# Altium schematic sheet NEMA_POWER.SchDoc
size A3; SheetNumber: 2; SheetTotal: 4
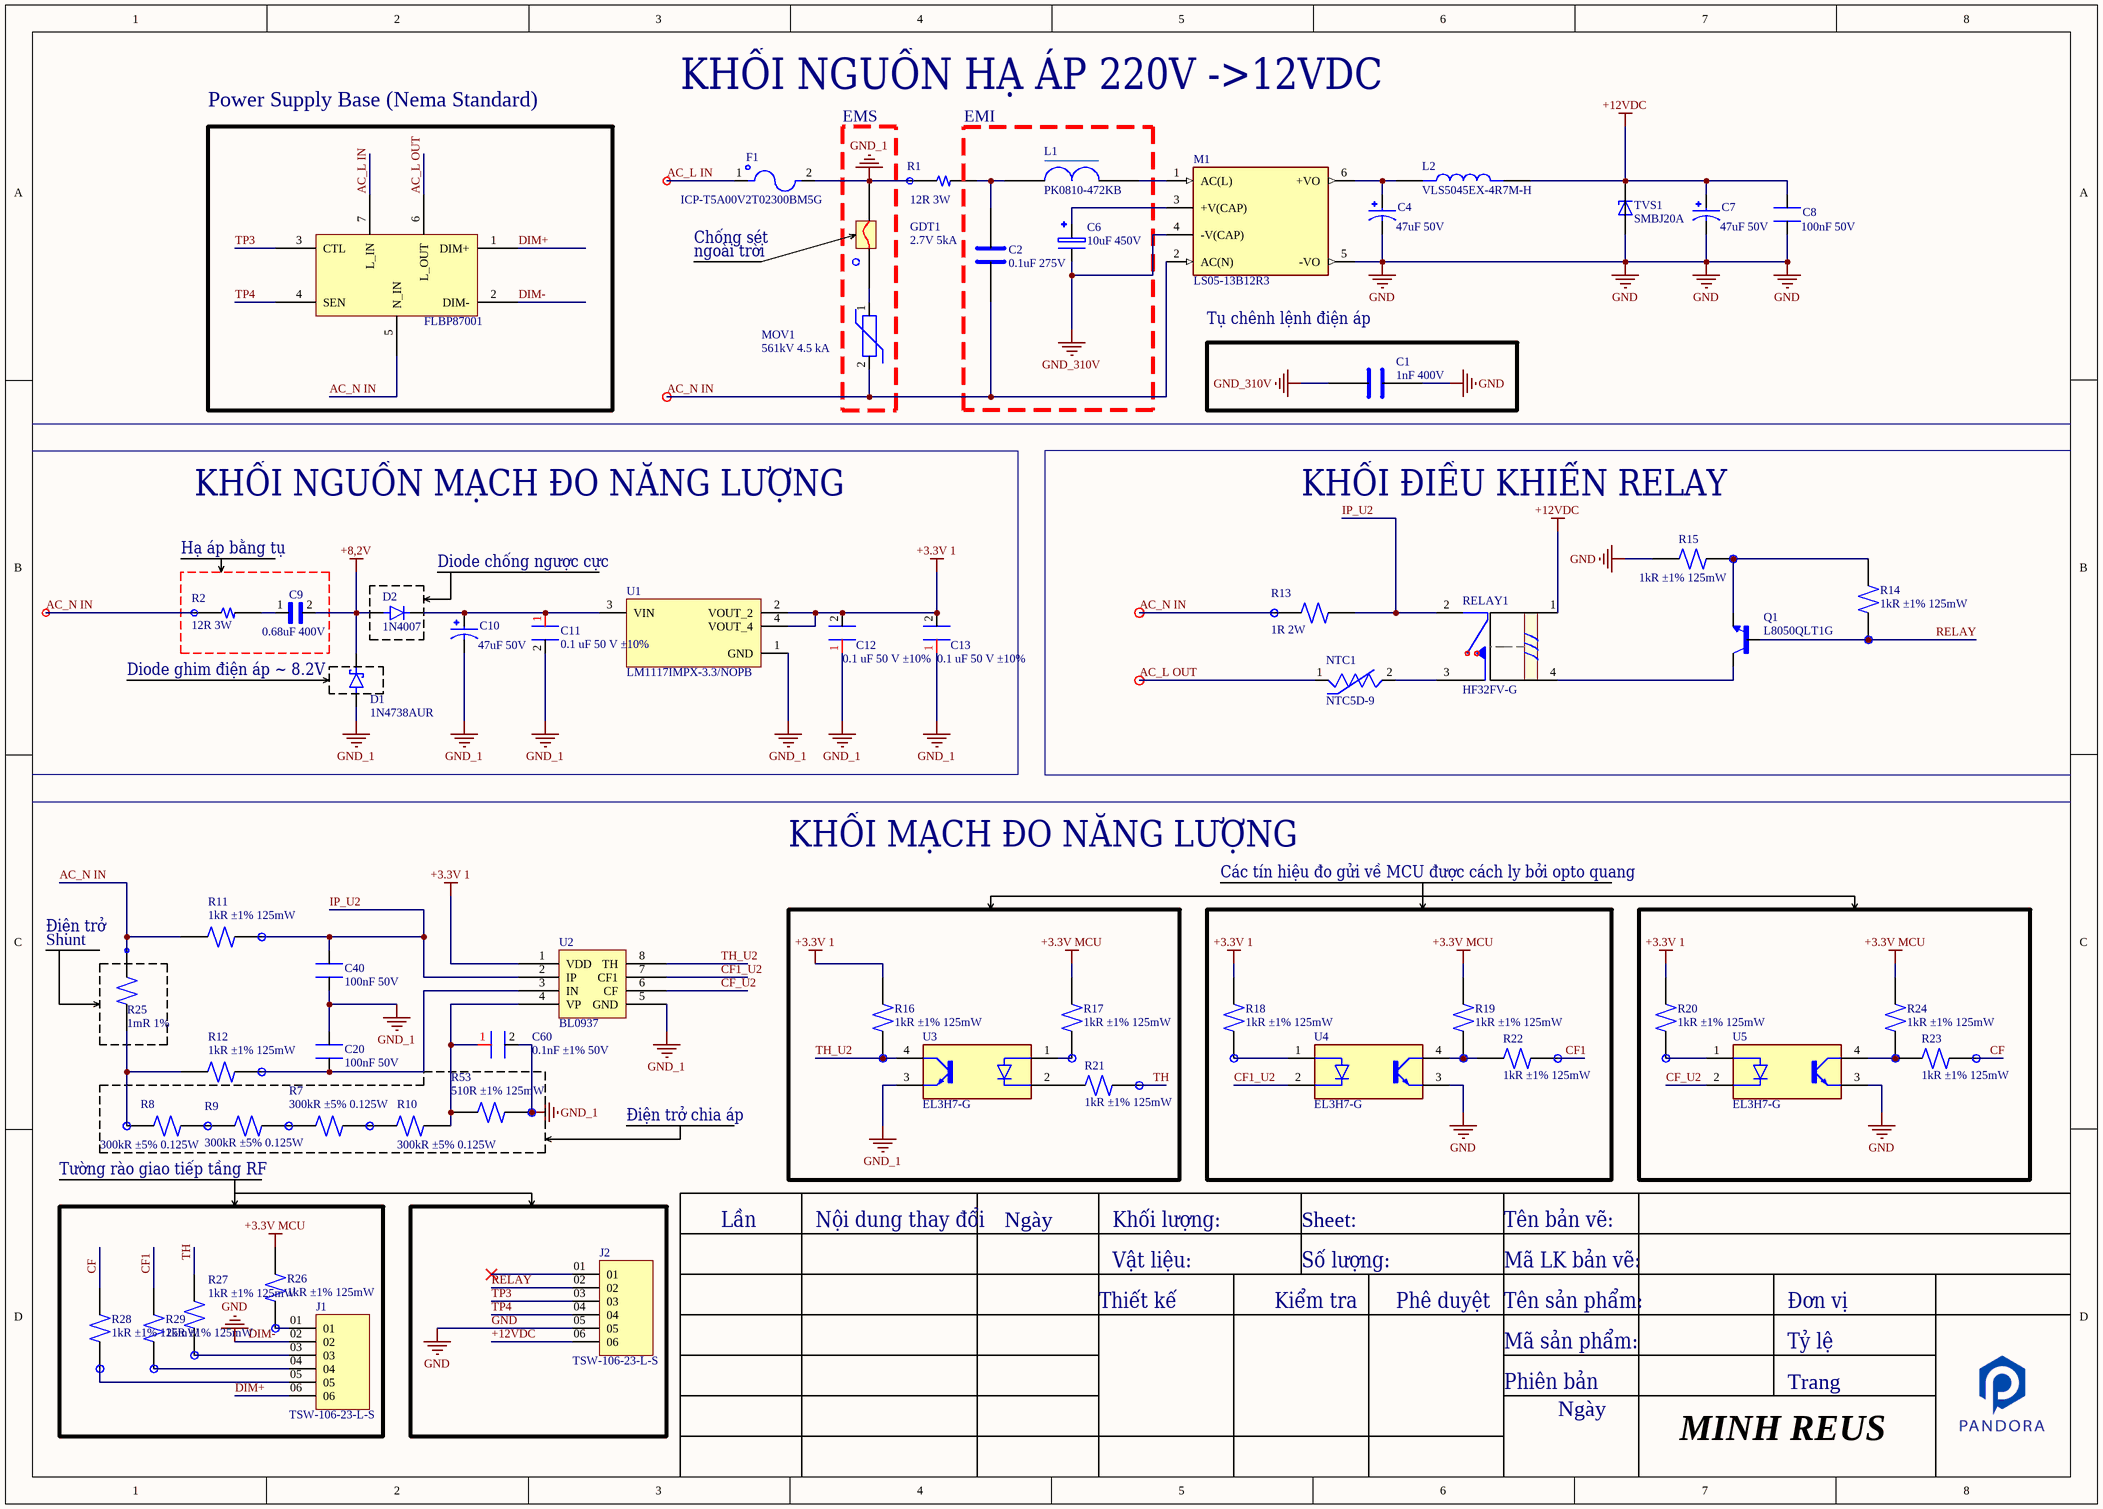
[diagram p0: NEMA_POWER.SchDoc]

## Parts
?  FLBP87001  [HEADER-JL241J]
C1  value 1nF 400V  [CAP-CER HIGH VOLTAGE 12x5mm]  (hidden comment: JD102MY5U)
C2  Values: 0.1uF 275V  [CAP_FILM DIP 0.1uF 15x12x4mm]  (hidden comment: ECW-FE2W154JA)
C4  value 47uF 50V  [CAP-POLARIZED_TH 50V 5x2.5mm]  (hidden comment: ECA1HM470)
C6  value 10uF 450V  [CAP-POLARIZED TH 450V 13x5mm]  (hidden comment: ECA2WHG100E)
C7  value 47uF 50V  [CAP-POLARIZED_TH 50V 5x2.5mm]  (hidden comment: ECA1HM470)
C8  value 100nF 50V  [CAP-CER_0805 SMD 2.01x1.25mm]  (hidden comment: SMC0805K104)
C9  value 0.68uF 400V  [CAP-FILM 0.68uF 400V DIP 15x18x7.8mm]  (hidden comment: P684J400)
C10  value 47uF 50V  [CAP-POLARIZED_TH 50V 5x2.5mm]  (hidden comment: ECA1HM470)
C11  0.1 uF 50 V ±10%  [CAP-CER_0805 SMD 2.01x1.25mm]
C12  0.1 uF 50 V ±10%  [CAP-CER_0805 SMD 2.01x1.25mm]
C13  0.1 uF 50 V ±10%  [CAP-CER_0805 SMD 2.01x1.25mm]
C20  value 100nF 50V  [CAP-CER_0805 SMD 2.01x1.25mm]  (hidden comment: SMC0805K104)
C40  value 100nF 50V  [CAP-CER_0805 SMD 2.01x1.25mm]  (hidden comment: SMC0805K104)
C60  0.1nF ±1% 50V  [CAP-CER_0805 SMD 2.01x1.25mm]
D1  1N4738AUR  [DIODE-ZENER 1N4738AUR]
D2  1N4007  [DIODE-RETIFIER_1N4007]
F1  ICP-T5A00V2T02300BM5G  [FUSE_ICP-T5A00V2T02300BM5G 3.6x10mm]
GDT1  value 2.7V 5kA  [VAR-GDT_5kA]  (hidden comment: GDT28H-270-BRP)
J1  TSW-106-23-L-S  [JUMP-6PIN_TH]
J2  TSW-106-23-L-S  [JUMP-6PIN_TH]
L1  PK0810-472KB  [IND-TH_0810 7x11mm]
L2  VLS5045EX-4R7M-H  [IND-SMD_VLS5045EX-4R7M-H 4.5X5.3MM]
M1  LS05-13B12R3  [MODULE-AC/DC_LS05-13B05R3]
MOV1  value 561kV 4.5 kA  [VAR-MOV_14D561K]  (hidden comment: MOV-14D471K)
NTC1  NTC5D-9  [RES-NTC_NTC5D-9 4x9mm]
Q1  L8050QLT1G  [TRANS-NPN_L8050QLT1G]
R1  value 12R 3W  [RES_2512 SMD 6.3x2.15x0.7mm]  (hidden comment: 2176231-3)
R2  value 12R 3W  [RES_2512 SMD 6.3x2.15x0.7mm]  (hidden comment: 2176231-3)
R7  300kR ±5% 0.125W  [RES_0805 2x1.25mm]
R8  300kR ±5% 0.125W  [RES_0805 2x1.25mm]
R9  300kR ±5% 0.125W  [RES_0805 2x1.25mm]
R10  300kR ±5% 0.125W  [RES_0805 2x1.25mm]
R11  1kR ±1% 125mW  [RES_0805 2x1.25mm]
R12  1kR ±1% 125mW  [RES_0805 2x1.25mm]
R13  value 1R 2W  [RES_2512 SMD 6.3x2.15x0.7mm]  (hidden comment: PA2512FKE7W0R001E)
R14  1kR ±1% 125mW  [RES_0805 2x1.25mm]
R15  1kR ±1% 125mW  [RES_0805 2x1.25mm]
R16  1kR ±1% 125mW  [RES_0805 2x1.25mm]
R17  1kR ±1% 125mW  [RES_0805 2x1.25mm]
R18  1kR ±1% 125mW  [RES_0805 2x1.25mm]
R19  1kR ±1% 125mW  [RES_0805 2x1.25mm]
R20  1kR ±1% 125mW  [RES_0805 2x1.25mm]
R21  1kR ±1% 125mW  [RES_0805 2x1.25mm]
R22  1kR ±1% 125mW  [RES_0805 2x1.25mm]
R23  1kR ±1% 125mW  [RES_0805 2x1.25mm]
R24  1kR ±1% 125mW  [RES_0805 2x1.25mm]
R25  value 1mR 1%  [RES_6432]  (hidden comment: CRE2512-FZ-R002E-3)
R26  1kR ±1% 125mW  [RES_0805 2x1.25mm]
R27  1kR ±1% 125mW  [RES_0805 2x1.25mm]
R28  1kR ±1% 125mW  [RES_0805 2x1.25mm]
R29  1kR ±1% 125mW  [RES_0805 2x1.25mm]
R53  510R ±1% 125mW  [RES_0805 2x1.25mm]
RELAY1  HF32FV-G  [RELAY 10A 4PIN 0.2x18.4mm]
TVS1  SMBJ20A  [DIODE-TVS_SMD SMBJ20A 2x0.8mm]
U1  LM1117IMPX-3.3/NOPB  [IC_LM1117IMPX-3.3V]
U2  BL0937  [IC_BL0937]
U3  EL3H7-G  [TRANS-OPTO_EL3H7-G]
U4  EL3H7-G  [TRANS-OPTO_EL3H7-G]
U5  EL3H7-G  [TRANS-OPTO_EL3H7-G]

## Blocks framed on the sheet
Power Supply Base (Nema Standard): ?
EMS: GDT1 MOV1
EMI: C2 C6 L1
Tụ chênh lệnh điện áp: C1
Hạ áp bằng tụ: C9 R2

## Nets
+3.3V 1: C12.2 C13.2 R16.2 R18.2 R20.2 U1.2(VOUT_2) U1.4(VOUT_4) U2.1(VDD)
+3.3V MCU: R17.2 R19.2 R24.2 R26.2
+8,2V: C9.2 D1.K D2.A
+12VDC: C7.1 C8.2 J2.06 L2.2 RELAY1.1 TVS1.C
DIM-: ?.2(DIM-) C1.2 C4.2 C7.2 C8.1 J1.02 J2.05 M1.5(-VO) R15.2 TVS1.A U4.3(E) U5.3(E)  [also labelled GND]
GND_1: C10.2 C11.2 C12.1 C13.1 C20.1 C40.2 C60.2 D1.A F1.2 GDT1.1 R1.1 R53.1 U1.1(GND) U2.5(GND) U3.3(E)
GND_310V: C1.1 C6.2 M1.4(-V(CAP))
AC_L IN: ?.7(L_IN) F1.1
AC_L OUT: ?.6(L_OUT) NTC1.1
AC_N IN: ?.5(N_IN) C2.1 M1.2(AC(N)) MOV1.2 R2.1 R11.2 R13.1 R25.1
CF: R23.1 R28.2
CF1: R22.1 R29.2
CF1_U2: U2.7(CF1) U4.2(C)
CF_U2: U2.6(CF) U5.2(C)
DIM+: ?.1(DIM+) J1.06
IP_U2: C40.1 R11.1 R13.2 RELAY1.2 U2.2(IP)
RELAY: J2.02 Q1.1(B) R14.1
TH: R21.1 R27.2
TH_U2: R16.1 U2.8(TH) U3.4(CO)
TP3: ?.3(CTL) J2.03
TP4: ?.4(SEN) J2.04
NetC2_2: C2.2 L1.1 R1.2
NetC4_1: C4.1 L2.1 M1.6(+VO)
NetC6_1: C6.1 M1.3(+V(CAP))
NetC9_1: C9.1 R2.2
NetC10_1: C10.1 C11.1 D2.C U1.3(VIN)
NetC20_2: C20.2 R12.1 U2.3(IN)
NetC60_1: C60.1 R10.2 R53.2 U2.4(VP)
NetGDT1_2: GDT1.2 MOV1.1
NetJ1_01: J1.01 R26.1
NetJ1_03: J1.03 R27.1
NetJ1_04: J1.04 R29.1
NetJ1_05: J1.05 R28.1
NetL1_2: L1.2 M1.1(AC(L))
NetNTC1_2: NTC1.2 RELAY1.3
NetQ1_2: Q1.2(E) R14.2 R15.1
NetQ1_3: Q1.3(C) RELAY1.4
NetR7_1: R7.1 R9.2
NetR7_2: R7.2 R10.1
NetR8_1: R8.1 R12.2 R25.2
NetR8_2: R8.2 R9.1
NetR17_1: R17.1 U3.1(A)
NetR18_1: R18.1 U4.1(A)
NetR19_1: R19.1 R22.2 U4.4(CO)
NetR20_1: R20.1 U5.1(A)
NetR21_2: R21.2 U3.2(C)
NetR23_2: R23.2 R24.1 U5.4(CO)

Not connected (* = marked no-connect by the designer): J2 01*

## Notes on the sheet
- KHỐI NGUỒN HẠ ÁP 220V ->12VDC
- (near F1) Chống sét
- ngoài trời
- KHỐI NGUỒN MẠCH ĐO NĂNG LƯỢNG
- KHỐI ĐIỀU KHIỂN RELAY
- Diode chống ngược cực
- (near D1) Diode ghim điện áp ~ 8.2V
- KHỐI MẠCH ĐO NĂNG LƯỢNG
- Các tín hiệu đo gửi về MCU được cách ly bởi opto quang
- (near R25) Điện trở
- (near R25) Shunt
- Điện trở chia áp
- Tường rào giao tiếp tầng RF
- Lần
- Nội dung thay đổi
- Ngày
- Khối lượng:
- Sheet:
- Tên bản vẽ:
- Thiết kế
- Vật liệu:
- Kiểm tra
- Số lượng:
- Phê duyệt
- Mã LK bản vẽ:
- Tên sản phẩm:
- Đơn vị
- Mã sản phẩm:
- Phiên bản
- Tỷ lệ
- Trang
- MINH REUS

## Library data of the parts
? = HEADER AC_IN ;NEMA BASE: HEADER AC_IN ;NEMA BASE AC VOLTAGE FLBP87001; 7 Contacts (3 Power, 4Signal) 84.00mm base diameter Non-vented; Manufacture: Commercial industrial; Link in VN: NA; Value: NA; Manufacture part number: FLBP87001; Link: https://www.amphenol-cs.com/product/flbp87001.html; Package: NEMA Standard
C1 = CAP_CER;TH;1nF 400V: CAP_CER;TH;1nF 400V; Safety ceramic capacitor high voltage; Manufacture: Radial; Link in VN: NA; Manufacture part number: JD102MY5U; Link: https://www.it-tronics.de/en/ceramic-capacitor-1nf-400v-ac-hitano-jd102my5u-y1-d6x5mm-1000pf/; Package: DIP TH
C2 = CAR_FILM;TH; 0.1uF 275V: CAR FILM Polypropylene Film Capacitor ;TH; 0.1uF 275V ECW-FE2W154JA; Manufacture: Panasonic; Manufacture part number: ECW-FE2W154JA; Link: https://www.amazon.in/Electrical-Learner-0-1uF-Polypropylene-Capacitors/dp/B0CKS3FGZN; Link in VN: https://vietnamese.safety-capacitor.com/sale-34458434-small-size-reduction-voltage-self-healing-capacitor-0-1uf-275v-310v.html; Package: DIP
C4 C7 C10 = CAP_ALUM; TH;47µF 50V: CAP ALUM POLARIZED; TH ;47µF 50V Aluminum Electrolytic Capacitors Radial, Can 2000 Hrs @ 85Â°C; MF: Panasonic Electronic; MP: ECA1HM470; SnapEDA_Link: https://www.snapeda.com/parts/ECA1HM470/Panasonic%20Electronic%20Components/view-part/562975/?ref=snap; Availability: In Stock; Package: RADIAL-2 Panasonic; Price: None; Check_prices: https://www.snapeda.com/parts/ECA1HM470/Panasonic%20Electronic%20Components/view-part/562975/?ref=eda; Purchase-URL: https://pricing.snapeda.com/search/part/ECA1HM470/?ref=eda
C6 = CAP_ALUM;TH;10UF 20% 450V: CAP ALUM 10UF 20% 450V RADIAL; MF: Panasonic; MP: ECA-2WHG100E; SnapEDA_Link: https://www.snapeda.com/parts/ECA-2WHG100E/Panasonic/view-part/?ref=snap; Price: None; Package: RADIAL-2 Panasonic; Check_prices: https://www.snapeda.com/parts/ECA-2WHG100E/Panasonic/view-part/?ref=eda; Availability: In Stock
C8 C20 C40 = CAP_CER;SMD;100nF 10%;: CAP_CER;SMD;SMC0805K104; SMT 0805; X7R; 100nF 10%; 50V; -55C to +125C; Tech. PN X7R0805104K050DFCT1S000; MP: 885382207007; MF: Wurth Electronics Inc; Price: None; Availability: In Stock; Package: 0805 Wurth Electronics; SnapEDA_Link: https://www.snapeda.com/parts/885382207007/Wurth+Electronics+Inc/view-part/?ref=snap; Purchase-URL: https://pricing.snapeda.com/search/part/885382207007/?ref=eda; Check_prices: https://www.snapeda.com/parts/885382207007/Wurth+Electronics+Inc/view-part/?ref=eda
C9 = CAP_FILM;SMD;0.68uF 400V: CAP_FILM;SMD;0.68uF 400V P684J400; TH; Manufacture: Generic; Manufacture part number: P684J400; Package: TH; Link: https://www.amazon.in/pitch-0-68UF-680nf-Polypropylene-capacitor/dp/B07GYLKPVC
C11-C13 = CAP_CER; SMD; 0.1uF 50V ±10%;0805;: Multilayer Ceramic Capacitor, 0.1 uF, 50 V, ± 10%, X7R, 0805 [2012 Metric]; Manufacturer: Kyocera AVX; Manufacturer Part Number: 08055C104K4T4A; Manufacture Cross: Vishay; Manufacture Part Number Cross: VJ0805Y104KBABE31; Library Make By: Minh Reus; Price: 0.0241 USD; Package: 0805; Value: 0.1uF 50V 10%; ComponentLink1URL: https://datasheet.ciiva.com/26904/getdatasheetpartid-74229-26904224.pdf?src-supplier=Verical; ComponentLink1Description: Link Datasheet; ComponentLink2URL: https://www.digikey.com/en/products/detail/kyocera-avx/08055C104K4T4A/1602855; ComponentLink2Description: Link Original; ComponentLink3URL: https://www.mouser.vn/ProductDetail/Vishay-Vitramon/VJ0805Y104KBABE31?qs=TLaLXeh6c70yB%252BsdRZoYCQ%3D%3D; ComponentLink3Description: Link Cross; Link: https://www.digikey.com/en/products/detail/kyocera-avx/08055C104K4T4A/1602855
C60 = CAP_CER;SMD;1nF ±1% 50V;0805: 1000 pF ±1% 50V Ceramic Capacitor X8R 0805 (2012 Metric); Manufacturer: KEMET; Manufacturer Part Number: C0805C102F5HACAUTO; Library Make By: Minh Reus; Price: 0.589 USD; Package: 0805; Value: 1nF ±1% 50V; ComponentLink1URL: https://search.kemet.com/datasheets/KEM_C1007_X8R_ULTRA_150C_SMD.pdf; ComponentLink1Description: Link Datasheet; Manufacture Cross: KEMET; Manufacture Part Number Cross: C0805C102F5HACAUTO; Link: https://www.digikey.in/en/products/detail/kemet/C0805C102F5HACAUTO/7958273; ComponentLink2Description: Link Cross; ComponentLink2URL: https://www.digikey.in/en/products/detail/kemet/C0805C102F5HACAUTO/7958273; ComponentLink3Description: Link Original; ComponentLink3URL: https://www.digikey.in/en/products/detail/kemet/C0805C102F5HACAUTO/7958273
D1 = DIODE ZENER;SMD;: DIODE ZENER;SMD 1N4738AUR; Zener voltage 8.2V; 1W Tc=30C; Manufacture: Microsemi; Value: 8.2V 1W; Package: DO-213AB; Manufacture part number: 1N4738AUR; Link: https://www.mouser.vn/ProductDetail/Microchip-Technology/1N4738AUR?qs=%252BRKXB2WKlScofCzKW5cc0Q%3D%3D
D2 = DIODE RECTIFIER; SMD;: DIODE RECTIFIER; SMD; Diode Standard 1000 V 1A SMD SOD123; Manufacture: NTE Electronics, Inc.; Value: 1000V; Package: SOD123; Link: https://www.lcsc.com/product-detail/Diodes-General-Purpose_TWGMC-1N4007_C727082.html; Manufacture part number: 1N4007; Link in VN: https://icdayroi.com/1n4007-m7
F1 = FUSE;DIP;: Ceramic tube fuse | Axial Pigtail  3.6×10 mm, 250mA~6.3A, 250VAC; Manufacture: Bel Fuse; Manufature part number: 0ADKP9160-RE; Value: NA; Package: DIP; Link in VN: https://snapeda.com/shop?store=DigiKey&id=4616374; Link: https://snapeda.com/shop?store=Mouser&id=4616374; SnapEDA_Link: https://www.snapeda.com/parts/0ADKP9160-RE/Bel%20Fuse/view-part/4616374/?ref=snap
GDT1 = VAR_GDT;DIP: Gas Discharge Tube 2.7kV 5kA / ; / (5kA);-40°C to +90°C ;Pole Through Hole; MF: BOURNS; Link: https://www.mouser.com/ProductDetail/Bourns/GDT28H-270-BRP?qs=1Kr7Jg1SGW%252B3UhoOt%2FsPFg%3D%3D; Package: DIP; MP: GDT28H-270-BRP
J1 J2 = JUMP 6 PIN;TH;: JUMP 6 PIN;TH;TSW - Samtec 2.54mm Pin Header 10.92mm Overall Pin Length (07) - Fast Stock; MF: Samtec Inc.; Value: NA; MP: TSW-106-XX-X-S; Package: 6 PIN TH; Link: https://www.mouser.com/ProductDetail/Samtec/TSW-106-23-L-S?qs=rU5fayqh%252BE08iNXgtUK34A%3D%3D
L1 = INDUCTOR;TH: INDUCTOR;TH; PK0810-472KB; 130mA  4.7mH  ±10%  7Ω; Manufacture: SXN(Shun Xiang Nuo Elec); Link in VN: NA; Manufacture part number: PK0810-472KB; Link: https://www.lcsc.com/product-detail/Radial-Inductor-TH_Shun-Xiang-Nuo-Elec-PK0810-472KB_C400323.html; Package: Plugin I type; Values: 4.7mH
L2 = INDUCTOR;SMD;: INDUCTOR;SMD;Inductor Power Shielded Wirewound 4.7uH 20% 100KHz Ferrite 3.2A 0.0468Ohm DCR Automotive T/R; MF: TDK Corporation; Value: 4.7uH; Price: None; MP: VLS5045EX-4R7M-H; SnapEDA_Link: https://www.snapeda.com/parts/VLS5045EX-4R7M-H/TDK/view-part/?ref=snap; Purchase-URL: https://pricing.snapeda.com/search/part/VLS5045EX-4R7M-H/?ref=eda; Package: NON STANDARD-2 TDK; Check_prices: https://www.snapeda.com/parts/VLS5045EX-4R7M-H/TDK/view-part/?ref=eda; Availability: In Stock
M1 = MODULE_AC/DC;TH;LS05-13B05R3: Open Frame AC DC Converters 1 Uitgang 12V 1A 85 ~ 305 VAC, 70 ~ 430 VDC Input; Manufacture: Mornsun America, LLC; Value: NA; SnapEDA_Link: https://www.snapeda.com/parts/LS05-13B05R3/MORNSUN/view-part/5508937/?ref=snap; Purchase-URL: https://pricing.snapeda.com/search/part/LS05-13B05R3/?ref=eda; Digi-Key_Part_Number: 2725-LS05-13B05R3-ND; Check_prices: https://www.snapeda.com/parts/LS05-13B05R3/MORNSUN/view-part/5508937/?ref=eda; Manufacture part number: LS05-13B05R3; Package: CUSTOM-6 MORNSUN
MOV1 = VAR_MOV;DIP;14D471K: 561kV 4.5 kA Varistor 1 Circuit Through; -55° C to + 125° C; Manufacture part number: MOV-14D561K; Manufacture: Bourns; SnapEDA_Link: https://www.snapeda.com/parts/MOV-14D471K/Bourns/view-part/?ref=snap; Package: Disc-14 Bourns; Link: https://pricing.snapeda.com/search/part/MOV-14D471K/?ref=eda
NTC1 = RES; TH; NTC Thermisrtor: 5Ω 3A Plugin,P=7.5mm NTC Thermistors ROHS /; Manufacture: VDR Varistor; Link in VN: NA; Manufacture part number: NTC5D-9; Link: https://www.lcsc.com/product-detail/NTC-Thermistors_VDR-Varistor-NTC-5D-9_C5240595.html; Package: Pluggin; Values: NA
Q1 = TRANSISTOR NPN;SMD;: TRANSISTOR NPN;SMD; L8050QLT1G SOT-23; VCE = 25V;IC = 800mA; Manufacture: LRC; Link in Vn: NA; Manufacture part number: L8050QLT1G; Values: NA; Package: SOT 23; Link: https://www.lcsc.com/product-detail/Transistors-NPN-PNP_L8050QLT1G_C49581.html
R1 R2 = RES;SMD;12R 3W: RES;SMD;12R 3W 1%; 2512; MF: TE Connectivity; Package: 2512; MP: 2176231-3; Link: https://www.mouser.com/ProductDetail/TE-Connectivity-Holsworthy/352212RFT?qs=Rv6LVDxB0ZpBjRvkCikjIg%3D%3D
R7-R10 = RES;SMD;300kR ±5% 0.125W;0805: 300 kOhms ±5% 0.125W, 1/8W Chip Resistor 0805 (2012 Metric) Moisture Resistant Thick Film; Manufacturer: YAGEO; Manufacturer Part Number: RC0805JR-07300KL; Library Make By: Minh Reus; Link: https://www.digikey.com/en/products/detail/yageo/RC0805JR-07300KL/728308; Package: 0805; Manufacture Cross: YAGEO; Manufacture Part Number Cross: RC0805JR-07300KL; ComponentLink1Description: Link Datasheet; ComponentLink1URL: https://www.yageo.com/upload/media/product/products/datasheet/rchip/PYu-RC_Group_51_RoHS_L_12.pdf; ComponentLink2Description: Link Origianal; ComponentLink2URL: https://www.digikey.com/en/products/detail/yageo/RC0805JR-07300KL/728308; Price: 0.0076 USD; ComponentLink3Description: Link Cross; ComponentLink3URL: https://www.mouser.com/ProductDetail/YAGEO/RC0805JR-07300KL?qs=KyGMWp10UkvoclFnbJ3y4g%3D%3D&srsltid=AfmBOopkyV86-kzeph5wHaPa9k8OVxzW-xozrT--F1zs-YHtlBarJoEY
R11 R12 R14-R24 R26-R29 R53 = RES;SMD;1kR ±1% 125mW;0805: SMD Chip Resistor, 1 kOhm, ± 1%, 125 mW, 0805 [2012 Metric], Thick Film, General Purpose; Manufacturer: Yageo; Manufacturer Part Number: RC0805FR-071KL; Manufacture Cross: Panasonic; Manufacture Part Number Cross: ERJ-U06F1001V; Library Make By: Minh Reus; Package: 0805; Value: 1kR ±1% 125mW; Link: https://www.digikey.com/en/products/detail/yageo/RC0805FR-071KL/727444; Price: 0.026 USD; ComponentLink1Description: Link Datasheet; ComponentLink1URL: https://www.mouser.com/datasheet/2/315/AOA0000C334-1314047.pdf; ComponentLink2Description: Link Cross; ComponentLink2URL: https://www.mouser.com/ProductDetail/Panasonic/ERJ-U06F1001V?qs=Yyy8avaXlIuMmWm2vlSlCQ%3D%3D; ComponentLink3Description: Link Original; ComponentLink3URL: https://www.digikey.com/en/products/detail/yageo/RC0805FR-071KL/727444
R13 = RES;SMD;1R 2W; PACKAGE 2512: RES;SMD;2512 1R 2W; Manufacture: YAGEO; Link in VN: NA; Manufacture part number: PA2512FKE7W0R001E; Link: https://www.mouser.vn/ProductDetail/YAGEO/PA2512FKE7W0R001E?qs=w%2Fv1CP2dgqr%2FZSUdIykUmQ%3D%3D; Package: 2512
R25 = RES SMD;1mR;3W: CRE2512-FZ-R002E-3,1 mOhms Â±1% 3W Chip Resistor 2512 (6432 Metric) Automotive AEC-Q200, Current Sense, Moisture Resistant Metal Element; MF: Bourns; Availability: Good; Price: None; MP: CRE2512-FZ-R002E-3; Package: 6432 Stackpole; DigiKey-Purchase-URL: https://snapeda.com/shop?store=DigiKey&id=2889504; SnapEDA_Link: https://www.snapeda.com/parts/CRE2512-FZ-R002E-3/Bourns/view-part/2889504/?ref=snap; Mouser-Purchase-URL: https://snapeda.com/shop?store=Mouser&id=2889504
RELAY1 = RELAY 10A;DIP: RELAY 10A;DIP;HF32FV-G; Dielectric strenght 4kV; Manufacture: HONGFA  RELAY; Manufacture part number: HF32FV-G; Link: https://jlcpcb.com/partdetail/3385059-HF32FV_G_5_HSTF_590/C2976839?gad_source=1&gclid=CjwKCAjwrvyxBhAbEiwAEg_Kggzsubv7LJyZKWdZUmnJDDktjCoFIZy7Wb7OQvN8qh-PhAayUkFcnxoCm90QAvD_BwE; Package: DIP; Values: 10A
TVS1 = DIODE_TVS;SMD;: DIODE_TVS;SMD;SMBJ20A;32.4V Clamp 18.6A Ipp Tvs Diode Surface Mount DO-214AA (SMBJ); MF: Littelfuse; Price: None; Value: *; Purchase-URL: https://pricing.snapeda.com/search/part/SMBJ20A/?ref=eda; Check_prices: https://www.snapeda.com/parts/SMBJ20A/Littelfuse/view-part/?ref=eda; Package: DO-214 Littelfuse; Availability: In Stock; SnapEDA_Link: https://www.snapeda.com/parts/SMBJ20A/Littelfuse/view-part/?ref=snap; MP: SMBJ20A
U1 = IC LDO; SMD: IC LDO; SMD; LM1117IMPX-3.3/NOPB; 800-mA 15-V linear voltage regulator; Manufacture part number: LM1117IMPX-3.3/NOPBTR-ND; Manufacture: Texas Instrustment; Value: NA; Link: https://www.snapeda.com/parts/LM1117IMPX-3.3/NOPB/Texas+Instruments/view-part/?ref=eda; Package: SOT-223-4 Texas Instruments
U2 = IC_ENERGY_MEASURE;SMD;SOP-8PP: IC_ENERGY_MEASURE;SMD;SOP-8PP  BL0937; VCC=3.3V;; Manufacture: BL (Shanghai Belling); Manufacture part number: BL0937; value: VCC=3.3V; Package: SOP8-PP; Link: https://www.lcsc.com/product-detail/Energy-Metering-ICs_BL-Shanghai-Belling-BL0937_C94616.html
U3-U5 = TRANSISTOR OPTO;SMD;: TRANSISTOR OPTO: Optoisolator Transistor Output 3750Vrms 1 Channel 4-SSOP; Value: NA; MF: Everlight Electronics; Check_prices: https://www.snapeda.com/parts/EL3H7-G/Everlight+Electronics+Co+Ltd/view-part/?ref=eda; MP: EL3H7-G; Link: https://octopart.com/datasheet/el3h7%28b%29%28ta%29-vg-everlight-12419000; Package: SSOP-4 Everlight Electronics; SnapEDA_Link: https://www.snapeda.com/parts/EL3H7-G/Everlight+Electronics+Co+Ltd/view-part/?ref=snap